# Altium schematic sheet Introduction.SchDoc
size 420 x 297 mm; Author: Denizhan ALTAY; SheetNumber: 1; SheetTotal: 4
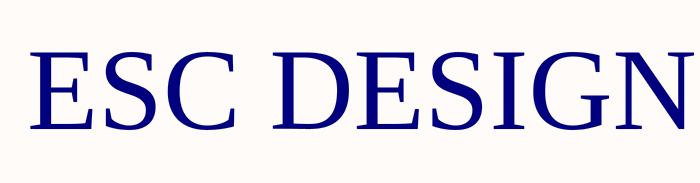
[diagram p0: Introduction.SchDoc]

## Notes on the sheet
- ESC DESIGN
- THIS DOCUMENT AND THE DATA DISCLOSED HEREIN OR
- HEREWITH IS THE PROPERTY OF ALTIUM LIMITED AND MAY
- BE FREELY DISTRIBUTED IN WHOLE. NO RIGHTS ARE
- RESERVED OR EXPRESS OR IMPLIED WARANTEE GIVEN.
- Title :
- Size :
- Date :
- A3
- Sheet Number :
- Time :
- Revision :
- Author :
- File :